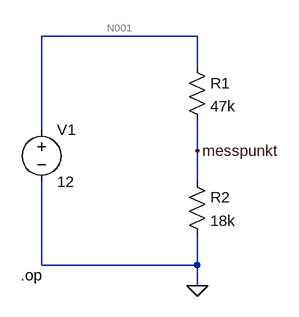
[diagram p0: schematic LED Schaltungen.asc]
LED Schaltungen.asc, the LTspice schematic file:
Version 4.1
SHEET 1 1456 1236
WIRE -1184 -384 -1424 -384
WIRE -1184 -336 -1184 -384
WIRE -1424 -240 -1424 -384
WIRE -1184 -208 -1184 -256
WIRE -1184 -160 -1184 -208
WIRE -1424 -32 -1424 -160
WIRE -1184 -32 -1184 -80
WIRE -1184 -32 -1424 -32
WIRE -1184 0 -1184 -32
FLAG -1184 -208 messpunkt
FLAG -1184 0 0
SYMBOL res -1200 -352 R0
SYMATTR InstName R1
SYMATTR Value 47k
SYMBOL res -1200 -176 R0
SYMATTR InstName R2
SYMATTR Value 18k
SYMBOL voltage -1424 -256 R0
WINDOW 123 0 0 Left 0
WINDOW 39 0 0 Left 0
SYMATTR InstName V1
SYMATTR Value 12
TEXT -1456 -16 Left 2 !.op

The netlist it stands for:
* LED Schaltungen.asc
R1 N001 messpunkt 47k
R2 messpunkt 0 18k
V1 N001 0 12
.op
.backanno
.end

* Results of the author's LTspice run, read from the files saved beside the schematic
* Operating Point:
*   V(messpunkt) = 3.323 V
*   V(n001) = 12 V
*   I(V1) = -184.6 µA
*   I(R1) = 184.6 µA
*   I(R2) = 184.6 µA